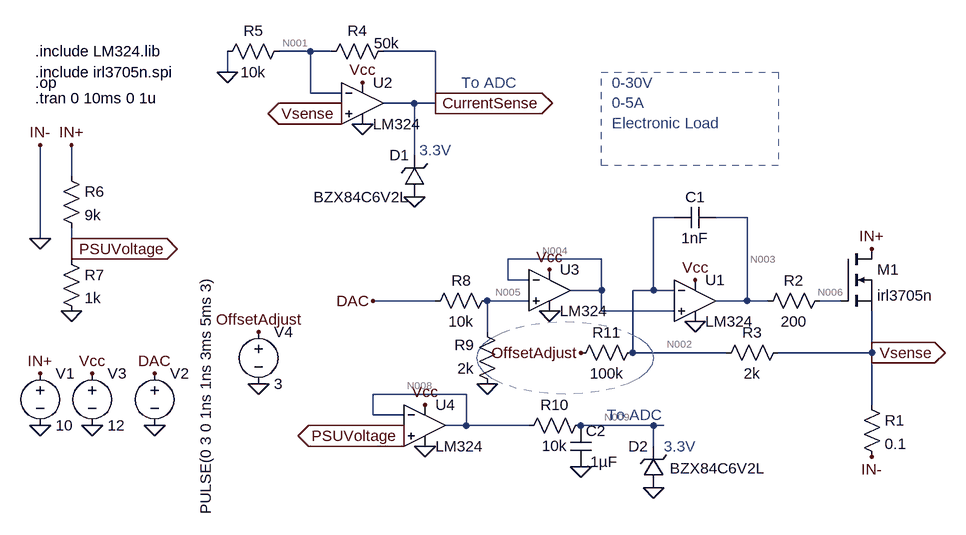
[diagram p0: schematic Op-AmpDrivingNMos.asc]
Op-AmpDrivingNMos.asc, the LTspice schematic file:
Version 4
SHEET 1 880 680
WIRE -624 -560 -672 -560
WIRE -592 -560 -624 -560
WIRE -432 -560 -512 -560
WIRE -752 -528 -752 -560
WIRE -624 -496 -624 -560
WIRE -576 -496 -624 -496
WIRE -464 -480 -512 -480
WIRE -432 -480 -432 -560
WIRE -432 -480 -464 -480
WIRE -464 -400 -464 -480
WIRE -992 -368 -992 -416
WIRE -64 -304 -96 -304
WIRE 48 -304 0 -304
WIRE -1040 -272 -1040 -416
WIRE -992 -256 -992 -288
WIRE -992 -240 -992 -256
WIRE -176 -240 -320 -240
WIRE -320 -208 -320 -240
WIRE -288 -208 -320 -208
WIRE -176 -192 -176 -240
WIRE -176 -192 -224 -192
WIRE -96 -192 -96 -304
WIRE -96 -192 -128 -192
WIRE -64 -192 -96 -192
WIRE -432 -176 -528 -176
WIRE -288 -176 -352 -176
WIRE 48 -176 48 -304
WIRE 48 -176 0 -176
WIRE 80 -176 48 -176
WIRE 192 -176 160 -176
WIRE 240 -176 240 -208
WIRE -176 -160 -176 -192
WIRE -64 -160 -176 -160
WIRE -352 -128 -352 -176
WIRE -128 -96 -128 -192
WIRE 16 -96 -128 -96
WIRE 240 -96 240 -160
WIRE 240 -96 96 -96
WIRE -384 -32 -528 -32
WIRE 240 -16 240 -96
WIRE -528 0 -528 -32
WIRE -480 0 -528 0
WIRE -384 16 -384 -32
WIRE -384 16 -416 16
WIRE -288 16 -384 16
WIRE -96 16 -208 16
WIRE -80 16 -96 16
WIRE -96 48 -96 16
FLAG -1040 -64 IN+
FLAG -1040 16 0
FLAG -864 -64 DAC
FLAG -864 16 0
FLAG -960 -64 Vcc
FLAG -960 16 0
FLAG -32 -208 Vcc
FLAG -32 -144 0
FLAG 240 -256 IN+
FLAG 240 -96 Vsense
IOPIN 240 -96 Out
FLAG -544 -512 Vcc
FLAG -544 -448 0
FLAG -576 -464 Vsense
IOPIN -576 -464 Out
FLAG -752 -528 0
FLAG -432 -480 CurrentSense
IOPIN -432 -480 Out
FLAG -992 -416 IN+
FLAG -992 -160 0
FLAG -1040 -416 IN-
FLAG -1040 -272 0
FLAG -992 -256 PSUVoltage
IOPIN -992 -256 Out
FLAG 240 64 IN-
FLAG -528 -176 DAC
FLAG -352 -48 0
FLAG -256 -224 Vcc
FLAG -256 -160 0
FLAG -464 -336 0
FLAG -480 32 PSUVoltage
IOPIN -480 32 Out
FLAG -448 -16 Vcc
FLAG -448 48 0
FLAG -208 80 0
FLAG -96 112 0
FLAG -704 -128 OffsetAdjust
FLAG -704 -48 0
FLAG -208 -96 OffsetAdjust
DATAFLAG 208 -96 ""
DATAFLAG -128 -96 ""
DATAFLAG 176 -176 ""
SYMBOL OpAmps\\opamp2 -32 -240 R0
SYMATTR InstName U1
SYMATTR Value LM324
SYMBOL res 224 -32 R0
SYMATTR InstName R1
SYMATTR Value 0.1
SYMBOL voltage -1040 -80 R0
WINDOW 123 0 0 Left 0
WINDOW 39 0 0 Left 0
SYMATTR InstName V1
SYMATTR Value 10
SYMBOL voltage -864 -80 R0
WINDOW 3 79 -132 VRight 2
WINDOW 123 0 0 Left 0
WINDOW 39 0 0 Left 0
SYMATTR Value PULSE(0 3 0 1ns 1ns 3ms 5ms 3)
SYMATTR InstName V2
SYMBOL voltage -960 -80 R0
WINDOW 123 0 0 Left 0
WINDOW 39 0 0 Left 0
SYMATTR InstName V3
SYMATTR Value 12
SYMBOL nmos 192 -256 R0
SYMATTR InstName M1
SYMATTR Value irl3705n
SYMATTR Prefix X
SYMBOL res 176 -192 R90
WINDOW 0 0 56 VBottom 2
WINDOW 3 32 56 VTop 2
SYMATTR InstName R2
SYMATTR Value 200
SYMBOL res 112 -112 R90
WINDOW 0 0 56 VBottom 2
WINDOW 3 32 56 VTop 2
SYMATTR InstName R3
SYMATTR Value 2k
SYMBOL cap 0 -320 R90
WINDOW 0 0 32 VBottom 2
WINDOW 3 32 32 VTop 2
SYMATTR InstName C1
SYMATTR Value 1nF
SYMBOL OpAmps\\opamp2 -544 -544 R0
SYMATTR InstName U2
SYMATTR Value LM324
SYMBOL res -496 -576 R90
WINDOW 0 0 56 VBottom 2
WINDOW 3 -12 11 VTop 2
SYMATTR InstName R4
SYMATTR Value 50k
SYMBOL res -656 -576 R90
WINDOW 0 0 56 VBottom 2
WINDOW 3 32 56 VTop 2
SYMATTR InstName R5
SYMATTR Value 10k
SYMBOL res -1008 -384 R0
SYMATTR InstName R6
SYMATTR Value 9k
SYMBOL res -1008 -256 R0
SYMATTR InstName R7
SYMATTR Value 1k
SYMBOL res -336 -192 R90
WINDOW 0 0 56 VBottom 2
WINDOW 3 32 56 VTop 2
SYMATTR InstName R8
SYMATTR Value 10k
SYMBOL res -336 -32 R180
WINDOW 0 36 76 Left 2
WINDOW 3 36 40 Left 2
SYMATTR InstName R9
SYMATTR Value 2k
SYMBOL OpAmps\\opamp2 -256 -256 R0
SYMATTR InstName U3
SYMATTR Value LM324
SYMBOL zener -448 -336 R180
WINDOW 0 24 64 Left 2
WINDOW 3 24 0 Left 2
SYMATTR InstName D1
SYMATTR Value BZX84C6V2L
SYMATTR Description Diode
SYMATTR Type diode
SYMBOL OpAmps\\opamp2 -448 -48 R0
SYMATTR InstName U4
SYMATTR Value LM324
SYMBOL res -192 0 R90
WINDOW 0 0 56 VBottom 2
WINDOW 3 32 56 VTop 2
SYMATTR InstName R10
SYMATTR Value 10k
SYMBOL cap -224 16 R0
SYMATTR InstName C2
SYMATTR Value .1µF
SYMBOL zener -80 112 R180
WINDOW 0 24 64 Left 2
WINDOW 3 -156 30 Left 2
SYMATTR InstName D2
SYMATTR Value BZX84C6V2L
SYMATTR Description Diode
SYMATTR Type diode
SYMBOL voltage -704 -144 R0
WINDOW 123 0 0 Left 0
WINDOW 39 0 0 Left 0
SYMATTR InstName V4
SYMATTR Value 3
SYMBOL res -112 -112 R90
WINDOW 0 0 56 VBottom 2
WINDOW 3 32 56 VTop 2
SYMATTR InstName R11
SYMATTR Value 100k
TEXT -1048 -560 Left 2 !.include LM324.lib
TEXT -1048 -512 Left 2 !.op
TEXT -1048 -488 Left 2 !.tran 0 10ms 0 1u
TEXT -1048 -528 Left 2 !.include irl3705n.spi
TEXT -160 -512 Left 2 ;0-30V\n0-5A\nElectronic Load
TEXT -392 -512 Left 2 ;To ADC
TEXT -456 -408 Left 2 ;3.3V
TEXT -168 0 Left 2 ;To ADC
TEXT -80 48 Left 2 ;3.3V
RECTANGLE Normal 96 -384 -176 -528 2
CIRCLE Normal -96 -32 -368 -144 2

The netlist it stands for:
* Op-AmpDrivingNMos.asc
XU1 N004 N002 Vcc 0 N003 LM324  ; pins In+ In- V+ V- OUT
R1 Vsense 0 0.1
V1 IN+ 0 10
V2 DAC 0 PULSE(0 3 0 1ns 1ns 3ms 5ms 3)
V3 Vcc 0 12
XM1 IN+ N006 Vsense irl3705n  ; pins D G S
R2 N006 N003 200
R3 Vsense N002 2k
C1 N003 N002 1nF
XU2 Vsense N001 Vcc 0 CurrentSense LM324  ; pins In+ In- V+ V- OUT
R4 CurrentSense N001 50k
R5 N001 0 10k
R6 IN+ PSUVoltage 9k
R7 PSUVoltage 0 1k
R8 N005 DAC 10k
R9 0 N005 2k
XU3 N005 N004 Vcc 0 N004 LM324  ; pins In+ In- V+ V- OUT
D1 0 CurrentSense BZX84C6V2L
XU4 PSUVoltage N008 Vcc 0 N008 LM324  ; pins In+ In- V+ V- OUT
R10 N009 N008 10k
C2 N009 0 .1µF
D2 0 N009 BZX84C6V2L
V4 OffsetAdjust 0 3
R11 N002 OffsetAdjust 100k
.model D D
.lib standard.dio
.include LM324.lib
.op
.tran 0 10ms 0 1u
.include irl3705n.spi
* 0-30V
* 0-5A
* Electronic Load
* To ADC
* 3.3V
* To ADC
* 3.3V
.backanno
.end

* Results of the author's LTspice run, read from the files saved beside the schematic
* Operating Point, zero values left out:
*   V(n003) = 31.66 mV
*   V(vcc) = 12 V
*   V(n002) = 58.85 mV
*   V(n004) = 30.28 mV
*   V(vsense) = 3.778 µV
*   V(in+) = 10 V
*   V(n006) = 31.66 mV
*   V(currentsense) = 58.9 mV
*   V(n001) = 9.967 mV
*   V(psuvoltage) = 1 V
*   V(n005) = 46.73 µV
*   V(n008) = 1 V
*   V(n009) = 1 V
*   V(offsetadjust) = 3 V
*   I(D2) = -1.501 nA
*   I(D1) = -1.346 nA
*   I(R11) = -29.41 µA
*   I(R10) = -1.501 nA
*   I(R9) = -23.36 nA
*   I(R8) = 4.673 nA
*   I(R7) = 1 mA
*   I(R6) = 1 mA
*   I(R5) = 996.7 nA
*   I(R4) = 978.7 nA
*   I(R3) = -29.42 µA
*   I(R2) = 9.968 pA
*   I(R1) = 37.78 µA
*   I(V4) = -29.41 µA
*   I(V3) = -1.624 mA
*   I(V2) = 4.673 nA
*   I(V1) = -1.008 mA
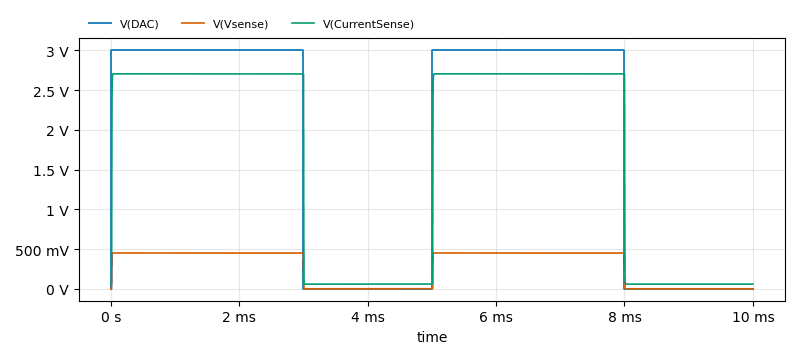
[diagram p1: Transient Analysis of Op-AmpDrivingNMos.asc, plotted from the saved traces]
* Transient Analysis, 1 run:
*   V(DAC): min 0 V, max 3 V, average 1.8 V, rms 2.324 V, last 0 V
*   V(Vsense): min -2.154 µV, max 450.6 mV, average 269.3 mV, rms 348.2 mV, last 3.778 µV
*   V(CurrentSense): min 58.89 mV, max 2.705 V, average 1.64 V, rms 2.09 V, last 58.9 mV